# Altium schematic sheet ECG_AFE_AD1832.SchDoc
size A; SheetNumber: 2; SheetTotal: 6
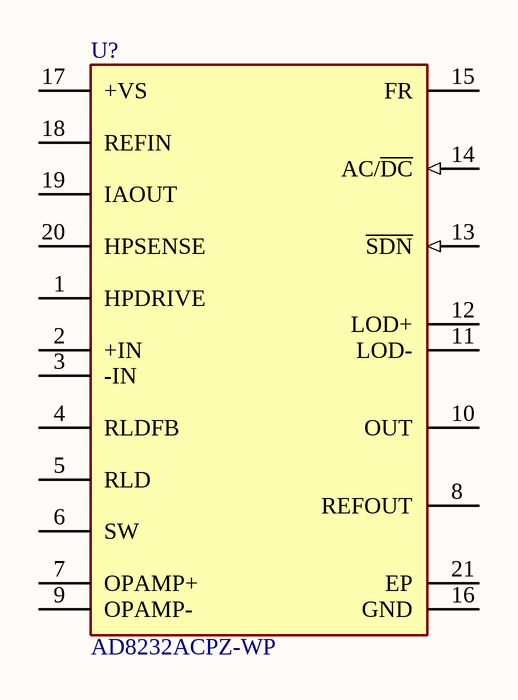
[diagram p0: ECG_AFE_AD1832.SchDoc]

## Parts
U?  AD8232ACPZ-WP  [FP-CP-20-8-IPC_A]

## Nets

Not connected (* = marked no-connect by the designer): U? 1(HPDRIVE) 2(+IN) 3(-IN) 4(RLDFB) 5(RLD) 6(SW) 7(OPAMP+) 8(REFOUT) 9(OPAMP-) 10(OUT) 11(LOD-) 12(LOD+) 13(~{SDN}) 14(AC/~{DC}) 15(FR) 16(GND) 17(+VS) 18(REFIN) 19(IAOUT) 20(HPSENSE) 21(EP)

## Library data of the parts
U? = CMP-09085-000022-1: IC ECG FRONT END 20LFCSP; Number of Channels: 1; Input Offset Voltage (Vos): 3mV; Slew Rate: 0.2V/µs; Min Supply Voltage: 2V; Power Supply Rejection Ratio (PSRR): 90dB; Max Supply Voltage: 3.5V; Input Bias Current: 200pA; Operating Supply Current: 170uA; Common Mode Rejection Ratio: 80dB; Gain Bandwidth Product: 100kHz; Packaging: Tray; RoHS Compliant: Yes; Radiation Hardening: No; Contact Plating: Tin; Number of Pins: 20; Width: 4.1mm; REACH SVHC: No SVHC; Mount: Surface Mount; Length: 4.1mm; Lead Free: Contains Lead; Case/Package: LFCSP EP; Min Operating Temperature: -40°C; Max Operating Temperature: 85°C; Height: 0.75mm; Series: -